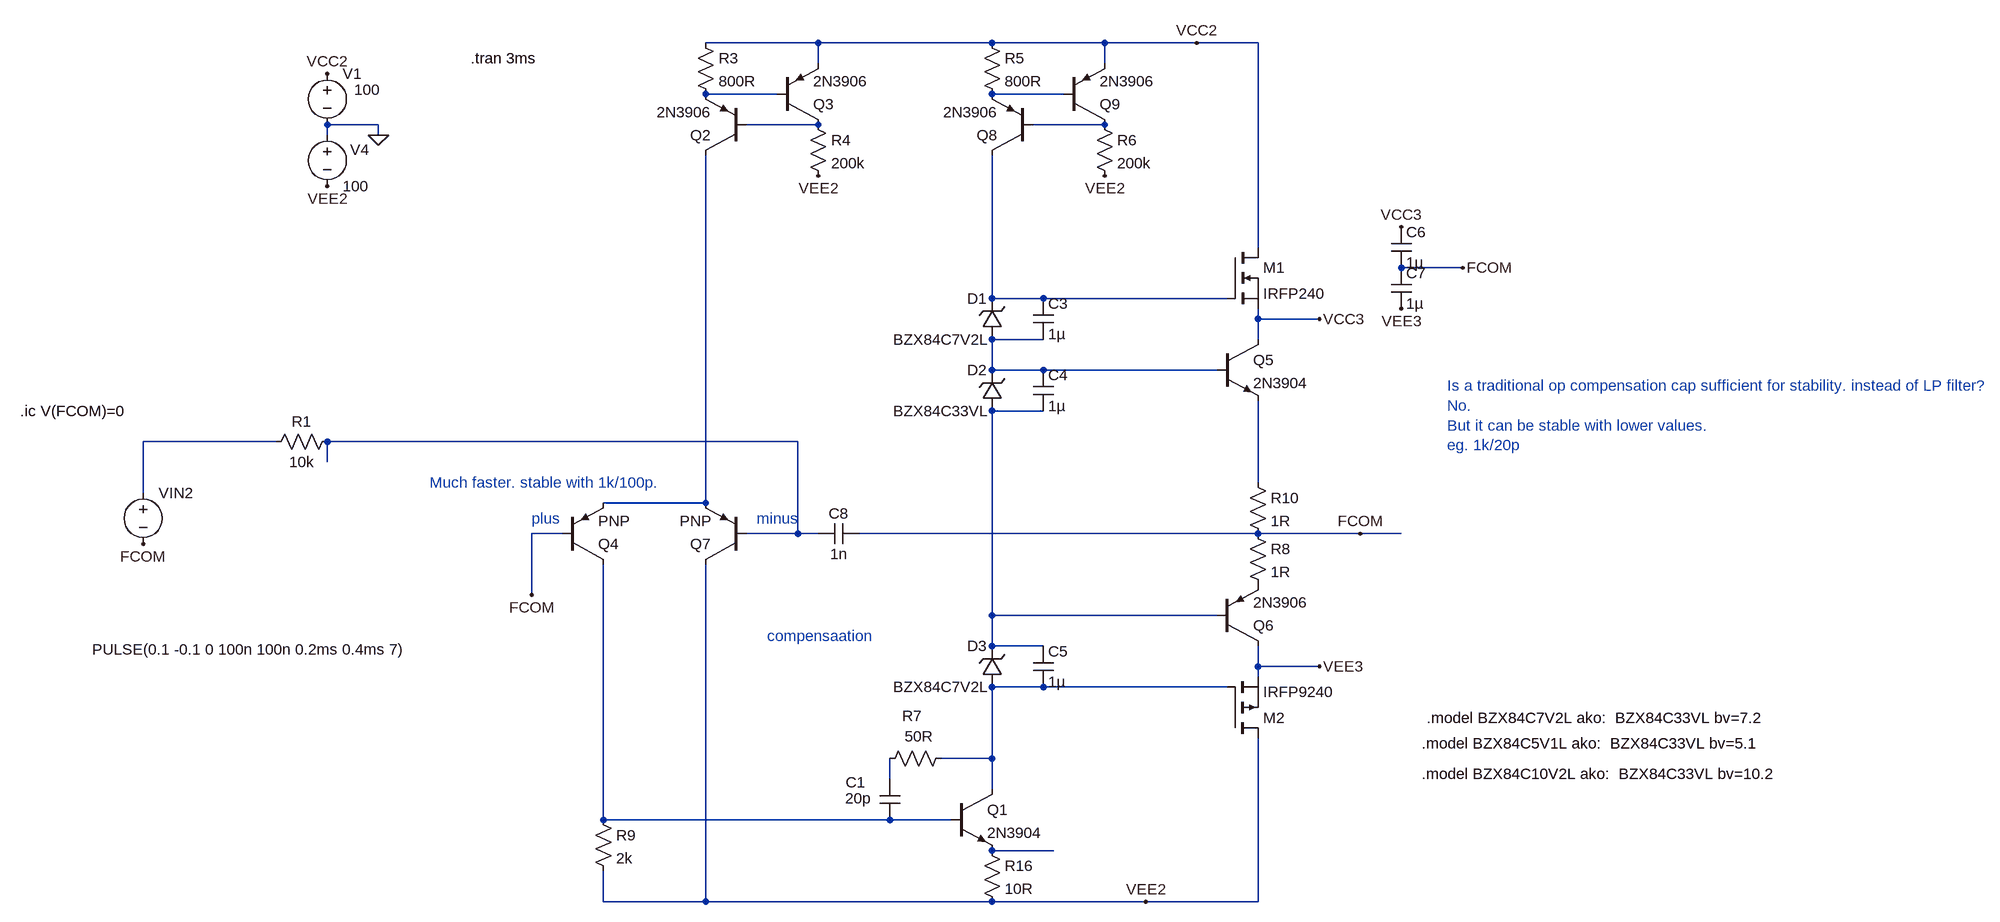
[diagram p0: schematic Draft50.asc]
Draft50.asc, the LTspice schematic file:
Version 4
SHEET 1 2756 992
WIRE 432 -416 256 -416
WIRE 704 -416 432 -416
WIRE 880 -416 704 -416
WIRE 1024 -416 880 -416
WIRE 1120 -416 1024 -416
WIRE 432 -384 432 -416
WIRE 880 -384 880 -416
WIRE 368 -336 256 -336
WIRE 816 -336 704 -336
WIRE -256 -288 -336 -288
WIRE 432 -288 320 -288
WIRE 880 -288 768 -288
WIRE -336 -272 -336 -288
WIRE -256 -272 -256 -288
WIRE 1120 -96 1120 -416
WIRE 1440 -64 1344 -64
WIRE 704 -16 704 -240
WIRE 784 -16 704 -16
WIRE 1072 -16 784 -16
WIRE 1120 16 1120 0
WIRE 1216 16 1120 16
WIRE 784 48 704 48
WIRE 1120 48 1120 16
WIRE 704 96 704 48
WIRE 784 96 704 96
WIRE 1056 96 784 96
WIRE 784 160 704 160
WIRE -416 208 -624 208
WIRE 400 208 -336 208
WIRE -336 240 -336 208
WIRE 1120 272 1120 144
WIRE -624 288 -624 208
WIRE 256 304 256 -240
WIRE 256 304 96 304
WIRE 32 352 -16 352
WIRE 400 352 400 208
WIRE 400 352 320 352
WIRE 432 352 400 352
WIRE 1120 352 496 352
WIRE 1280 352 1120 352
WIRE 1344 352 1280 352
WIRE -16 448 -16 352
WIRE 704 480 704 160
WIRE 1056 480 704 480
WIRE 704 528 704 480
WIRE 784 528 704 528
WIRE 1120 560 1120 528
WIRE 1216 560 1120 560
WIRE 1120 576 1120 560
WIRE 784 592 704 592
WIRE 1072 592 784 592
WIRE 704 704 704 592
WIRE 704 704 624 704
WIRE 544 736 544 704
WIRE 704 752 704 704
WIRE 96 800 96 400
WIRE 544 800 96 800
WIRE 640 800 544 800
WIRE 800 848 704 848
WIRE 96 928 96 880
WIRE 256 928 256 400
WIRE 256 928 96 928
WIRE 704 928 256 928
WIRE 944 928 704 928
WIRE 1120 928 1120 672
WIRE 1120 928 944 928
FLAG -256 -272 0
FLAG -336 -368 VCC2
FLAG -336 -192 VEE2
FLAG 944 928 VEE2
FLAG 1216 16 VCC3
FLAG 1216 560 VEE3
FLAG 432 -208 VEE2
FLAG 1024 -416 VCC2
FLAG 880 -208 VEE2
FLAG 1344 -128 VCC3
FLAG 1280 352 FCOM
FLAG 1440 -64 FCOM
FLAG 1344 0 VEE3
FLAG -624 368 FCOM
FLAG -16 448 FCOM
SYMBOL voltage -336 -384 R0
WINDOW 123 0 0 Left 0
WINDOW 39 0 0 Left 0
WINDOW 3 42 41 Left 2
SYMATTR Value 100
SYMATTR InstName V1
SYMBOL voltage -336 -288 R0
WINDOW 123 0 0 Left 0
WINDOW 39 0 0 Left 0
WINDOW 0 36 39 Left 2
SYMATTR InstName V4
SYMATTR Value 100
SYMBOL npn 1056 48 R0
SYMATTR InstName Q5
SYMATTR Value 2N3904
SYMBOL pnp 1056 528 M180
SYMATTR InstName Q6
SYMATTR Value 2N3906
SYMBOL res 80 784 R0
SYMATTR InstName R9
SYMATTR Value 2k
SYMBOL res 688 832 R0
SYMATTR InstName R16
SYMATTR Value 10R
SYMBOL pnp 32 400 M180
SYMATTR InstName Q4
SYMBOL pnp 320 400 R180
SYMATTR InstName Q7
SYMBOL voltage -624 272 R0
WINDOW 123 0 0 Left 0
WINDOW 39 0 0 Left 0
WINDOW 3 -80 261 Left 2
SYMATTR Value PULSE(0.1 -0.1 0 100n 100n 0.2ms 0.4ms 7)
SYMATTR InstName VIN2
SYMBOL cap 768 96 R0
SYMATTR InstName C4
SYMATTR Value 1µ
SYMBOL zener 720 160 R180
WINDOW 0 24 64 Left 2
WINDOW 3 24 0 Left 2
SYMATTR InstName D2
SYMATTR Value BZX84C33VL
SYMBOL npn 640 752 R0
SYMATTR InstName Q1
SYMATTR Value 2N3904
SYMBOL pnp 320 -240 R180
SYMATTR InstName Q2
SYMATTR Value 2N3906
SYMBOL pnp 368 -288 M180
SYMATTR InstName Q3
SYMATTR Value 2N3906
SYMBOL res 240 -432 R0
SYMATTR InstName R3
SYMATTR Value 800R
SYMBOL res 416 -304 R0
SYMATTR InstName R4
SYMATTR Value 200k
SYMBOL pnp 768 -240 R180
SYMATTR InstName Q8
SYMATTR Value 2N3906
SYMBOL pnp 816 -288 M180
SYMATTR InstName Q9
SYMATTR Value 2N3906
SYMBOL res 688 -432 R0
SYMATTR InstName R5
SYMATTR Value 800R
SYMBOL res 864 -304 R0
SYMATTR InstName R6
SYMATTR Value 200k
SYMBOL res 640 688 R90
WINDOW 0 -35 61 VBottom 2
WINDOW 3 -34 51 VTop 2
SYMATTR InstName R7
SYMATTR Value 50R
SYMBOL cap 528 736 R0
WINDOW 0 -53 5 Left 2
WINDOW 3 -54 30 Left 2
SYMATTR InstName C1
SYMATTR Value 20p
SYMBOL res 1104 336 R0
SYMATTR InstName R8
SYMATTR Value 1R
SYMBOL res 1104 256 R0
SYMATTR InstName R10
SYMATTR Value 1R
SYMBOL zener 720 48 R180
WINDOW 0 24 64 Left 2
WINDOW 3 24 0 Left 2
SYMATTR InstName D1
SYMATTR Value BZX84C7V2L
SYMBOL cap 768 -16 R0
SYMATTR InstName C3
SYMATTR Value 1µ
SYMBOL nmos 1072 -96 R0
SYMATTR InstName M1
SYMATTR Value IRFP240
SYMBOL pmos 1072 672 M180
SYMATTR InstName M2
SYMATTR Value IRFP9240
SYMBOL cap 768 528 R0
SYMATTR InstName C5
SYMATTR Value 1µ
SYMBOL cap 1328 -128 R0
SYMATTR InstName C6
SYMATTR Value 1µ
SYMBOL cap 1328 -64 R0
SYMATTR InstName C7
SYMATTR Value 1µ
SYMBOL zener 720 592 R180
WINDOW 0 24 64 Left 2
WINDOW 3 24 0 Left 2
SYMATTR InstName D3
SYMATTR Value BZX84C7V2L
SYMBOL res -320 192 R90
WINDOW 0 0 56 VBottom 2
WINDOW 3 32 56 VTop 2
SYMATTR InstName R1
SYMATTR Value 10k
SYMBOL cap 496 336 R90
WINDOW 0 0 32 VBottom 2
WINDOW 3 32 32 VTop 2
SYMATTR InstName C8
SYMATTR Value 1n
TEXT -112 -392 Left 2 !.tran 3ms
TEXT 336 328 Left 2 ;minus
TEXT -16 328 Left 2 ;plus
TEXT 1376 680 Left 2 !.model BZX84C5V1L ako:  BZX84C33VL bv=5.1
TEXT 1384 640 Left 2 !.model BZX84C7V2L ako:  BZX84C33VL bv=7.2
TEXT -176 272 Left 2 ;Much faster. stable with 1k/100p.
TEXT 1376 728 Left 2 !.model BZX84C10V2L ako:  BZX84C33VL bv=10.2
TEXT 1416 120 Left 2 ;Is a traditional op compensation cap sufficient for stability. instead of LP filter?\nNo.\nBut it can be stable with lower values.\neg. 1k/20p
TEXT 352 512 Left 2 ;compensaation
TEXT -816 160 Left 2 !.ic V(FCOM)=0

The netlist it stands for:
* Draft50.asc
V1 VCC2 0 100
V4 0 VEE2 100
Q5 VCC3 N006 N010 0 2N3904
Q6 VEE3 N007 P001 0 2N3906
R9 N014 VEE2 2k
R16 N015 VEE2 10R
Q4 N014 FCOM N011 0 PNP
Q7 VEE2 N009 N011 0 PNP
VIN2 N008 FCOM PULSE(0.1 -0.1 0 100n 100n 0.2ms 0.4ms 7)
C4 N006 N007 1µ
D2 N007 N006 BZX84C33VL
Q1 N012 N014 N015 0 2N3904
Q2 N011 N003 N001 0 2N3906
Q3 N003 N001 VCC2 0 2N3906
R3 VCC2 N001 800R
R4 N003 VEE2 200k
Q8 N005 N004 N002 0 2N3906
Q9 N004 N002 VCC2 0 2N3906
R5 VCC2 N002 800R
R6 N004 VEE2 200k
R7 N012 N013 50R
C1 N013 N014 20p
R8 FCOM P001 1R
R10 N010 FCOM 1R
D1 N006 N005 BZX84C7V2L
C3 N005 N006 1µ
M1 VCC2 N005 VCC3 VCC3 IRFP240
M2 VEE2 N012 VEE3 VEE3 IRFP9240
C5 N007 N012 1µ
C6 VCC3 FCOM 1µ
C7 FCOM VEE3 1µ
D3 N012 N007 BZX84C7V2L
R1 N009 N008 10k
C8 FCOM N009 1n
.model D D
.lib standard.dio
.model NPN NPN
.model PNP PNP
.lib standard.bjt
.model NMOS NMOS
.model PMOS PMOS
.lib standard.mos
.tran 3ms
* minus
* plus
.model BZX84C5V1L ako:  BZX84C33VL bv=5.1
.model BZX84C7V2L ako:  BZX84C33VL bv=7.2
* Much faster. stable with 1k/100p.
.model BZX84C10V2L ako:  BZX84C33VL bv=10.2
* Is a traditional op compensation cap sufficient for stability. instead of LP filter?
* No.
* But it can be stable with lower values.
* eg. 1k/20p
* compensaation
.ic V(FCOM)=0
.backanno
.end